# Altium project FLYBACK_SWITCHING_POWER_SUPPLY_V1_1.PrjPcb
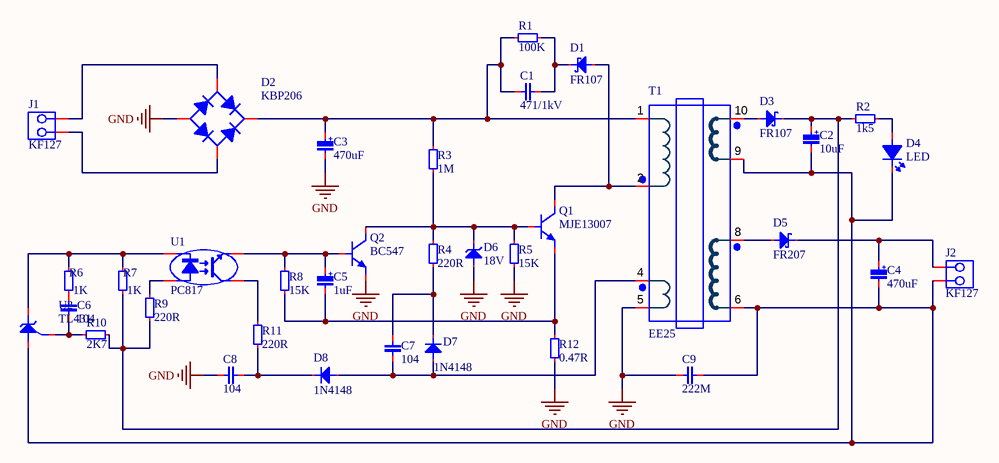
[diagram p0: FLYBACK_SWITCHING_POWER_SUPPLY_V1_1.SchDoc]
1 sheet, 36 parts. Net scope: global (net labels, ports and power ports of the same name join across sheets).
Board file: FLYBACK_SWITCHING_POWER_SUPPLY_V1_1.PcbDoc

## Sheet FLYBACK_SWITCHING_POWER_SUPPLY_V1_1.SchDoc
size A4; SheetNumber: 1; SheetTotal: 1

### Parts
C1  471/1kV  [CAP_Ceramic_5MM]
C2  10uF  [CAP_RAD_D05x11]
C3  470uF  [CAP_RAD_D10x12.5]
C4  470uF  [CAP_RAD_D10x12.5]
C5  1uF  [CAP_RAD_D05x11]
C6  104  [CAP_Ceramic_2.5MM]
C7  104  [CAP_Ceramic_2.5MM]
C8  104  [CAP_Ceramic_2.5MM]
C9  222M  [CAP_Ceramic_473M_9.65mm]
D1  FR107  [DO-204AL-BK]
D2  KBP206  [DIODE-KBP206]
D3  FR107  [DO-204AL-BK]
D4  LED  [LED_5MM]
D5  FR207  [DO-204AC-BK]
D6  18V  [DO-204AL-RD]
D7  1N4148  [DO-204AH-RD]
D8  1N4148  [DO-204AH-RD]
J1  KF127  [DG127-5.0-02P-14-00AH]
J2  KF127  [DG127-5.0-02P-14-00AH]
Q1  MJE13007  [TO-220-HEAT-SINK-1]
Q2  BC547  [TO-92]
R1  100K  [RES-0.5W-H]
R2  1k5  [RES-0.25W-H]
R3  1M  [RES-1W-V]
R4  220R  [RES-0.25W-H]
R5  15K  [RES-0.25W-H]
R6  1K  [RES-0.25W-H]
R7  1K  [RES-0.25W-H]
R8  15K  [RES-0.25W-H]
R9  220R  [RES-0.25W-H]
R10  2K7  [RES-0.25W-H]
R11  220R  [RES-0.25W-H]
R12  0.47R  [RES-1W-V]
T1  EE25  [TRANSFORMER-EE25-10-6-VERTICAL(5+5)]
U1  PC817  [PC817-DIP]
U2  TL431  [TO-92]

### Nets
GND: C3.2 C8.2 C9.2 D2.4(-) D6.1 Q2.3(E) R5.1 R12.1 T1.5
NetC1_1: C1.1 D1.2 R1.1
NetC1_2: C1.2 C3.1 D2.1(+) R1.2 R3.2 T1.1
NetC2_1: C2.1 D3.2 R2.2 R7.1 R9.1 R10.1
NetC2_2: C2.2 C4.2 C9.1 D4.2(K) J2.1 T1.6 T1.9 U2.2
NetC4_1: C4.1 D5.2 J2.2
NetC5_1: C5.1 Q2.2(B) R8.2 U1.3(E)
NetC5_2: C5.2 Q1.3(E) R8.1 R12.2
NetC6_1: C6.1 R6.1
NetC6_2: C6.2 R10.2 U2.1
NetC7_1: C7.1 D7.1 D8.1 T1.4
NetC7_2: C7.2 D7.2 R4.1
NetC8_1: C8.1 D8.2 R11.1
NetD1_1: D1.1 Q1.2(C) T1.2
NetD2_2: D2.2(AC) J1.1
NetD2_3: D2.3(AC) J1.2
NetD3_1: D3.1 T1.10
NetD4_1: D4.1(A) R2.1
NetD5_1: D5.1 T1.8
NetD6_2: D6.2 Q1.1(B) Q2.1(C) R3.1 R4.2 R5.2
NetR6_2: R6.2 R7.2 U1.2(K) U2.3
NetR9_2: R9.2 U1.1(A)
NetR11_2: R11.2 U1.4(C)

### Notes on the sheet
- (in symbol Capacitor(Radian)) +

### Library data of the parts
C1 C6-C9 = Capacitors(Disc)
C2-C5 = Capacitor(Radian)
D1 D3 = Diode-FR107: 1A 1000V
D2 = Diode-KBP206
D4 = LED 5MM
D5 = Diode-FR207
D6 = Diode-Zener
D7 D8 = Diode-1N4148: The fast switching diode
J1 J2 = DG127-5.0-02P-14-00AH
Q1 = Transistor-MJE13007
Q2 = Transistor-BC547: VCEO: 45 Vdc / VCBO: 50 Vdc / VEBO: 6.0 Vdc
R1-R12 = Resistors THD
T1 = TRANS-EE25-10-6-VERTICAL(5+5)
U1 = Opto-PC817
U2 = Ic-TL431